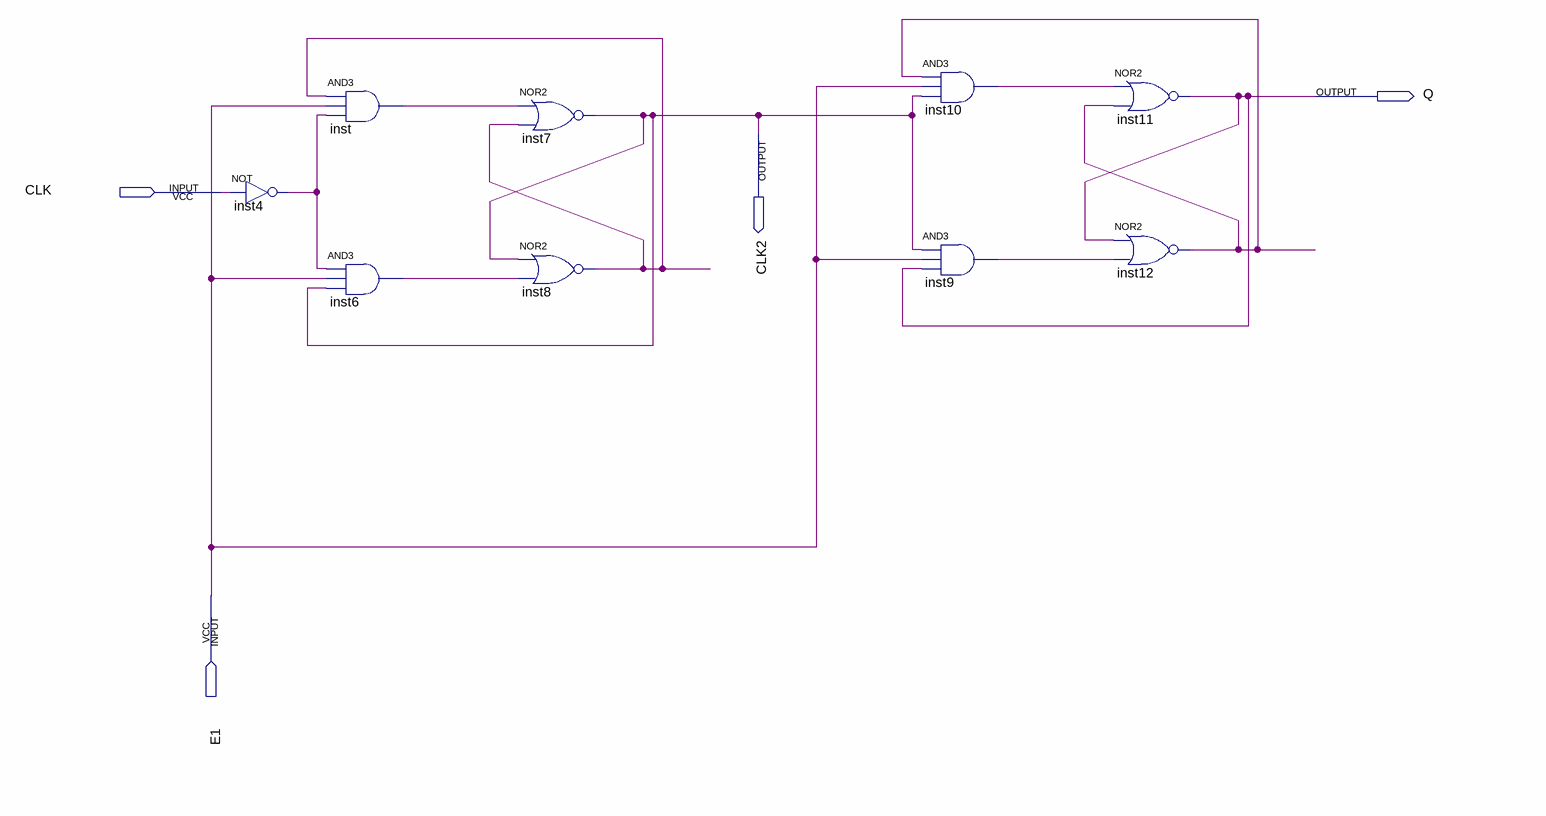
[diagram p0: schematic sheet]
// Quartus schematic flipflopJK_negedge1.bdf as structural Verilog: 9 symbols, 4 pins
module flipflopJK_negedge1 (
  input  CLK,
  input  E1,
  output Q,
  output CLK2
);

  wire inst4_out, inst6_out, inst8_out, inst9_out, inst10_out, inst12_out, inst_out;

  not inst4 (inst4_out, CLK);
  and inst (inst_out, inst8_out, E1, inst4_out);
  and inst6 (inst6_out, inst4_out, E1, CLK2);
  nor inst7 (CLK2, inst_out, inst8_out);
  nor inst8 (inst8_out, CLK2, inst6_out);
  and inst10 (inst10_out, inst12_out, E1, CLK2);
  and inst9 (inst9_out, CLK2, E1, Q);
  nor inst11 (Q, inst10_out, inst12_out);
  nor inst12 (inst12_out, Q, inst9_out);
endmodule
